# Altium schematic sheet DigitSegment_Schematic.SchDoc
size A
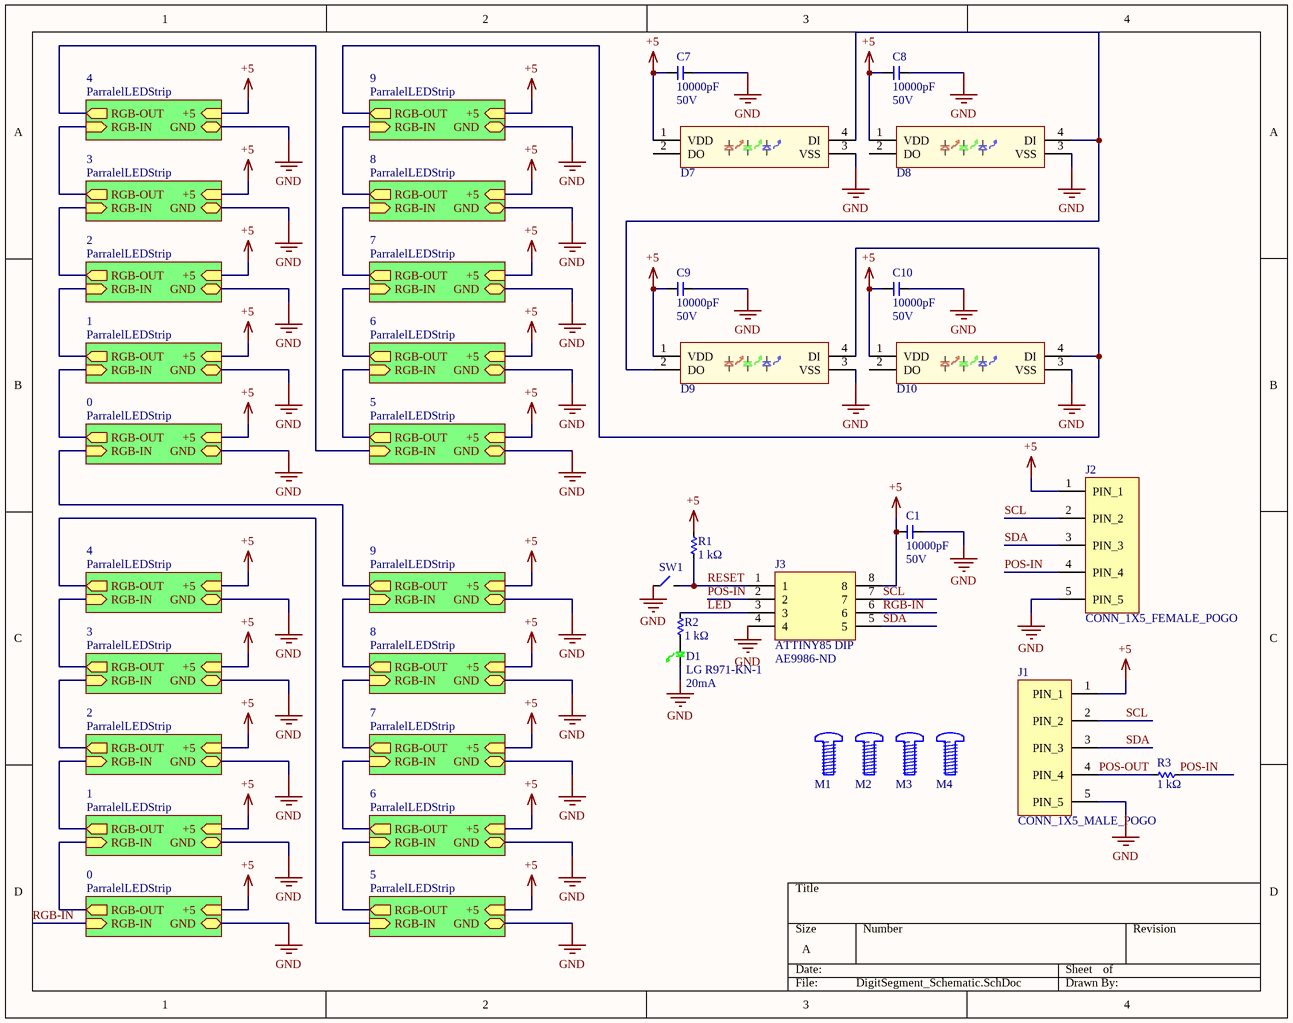
[diagram p0: DigitSegment_Schematic.SchDoc]

## Parts
C1  Capacitance (shorthand): 10000pF  Rated Voltage: 50V  [C0805]  (hidden comment: __template_cap)
C7  Capacitance (shorthand): 10000pF  Rated Voltage: 50V  [C0805]  (hidden comment: __template_cap)
C8  Capacitance (shorthand): 10000pF  Rated Voltage: 50V  [C0805]  (hidden comment: __template_cap)
C9  Capacitance (shorthand): 10000pF  Rated Voltage: 50V  [C0805]  (hidden comment: __template_cap)
C10  Capacitance (shorthand): 10000pF  Rated Voltage: 50V  [C0805]  (hidden comment: __template_cap)
D1  Manufacturer Part Number: LG R971-KN-1  Current - Test: 20mA  [0805_Diode]  (hidden comment: LED_LY971)
D7  LED_WS2812B  [4DFN5X5_WGS2812B]  (value not drawn)
D8  LED_WS2812B  [4DFN5X5_WGS2812B]  (value not drawn)
D9  LED_WS2812B  [4DFN5X5_WGS2812B]  (value not drawn)
D10  LED_WS2812B  [4DFN5X5_WGS2812B]  (value not drawn)
J1  CONN_1X5_MALE_POGO  [CONN_1X5_MALE_POGO]
J2  CONN_1X5_FEMALE_POGO  [CONN_1X5_FEMALE_POGO]
J3  ATTINY85 DIP  Supplier Part Number 1: AE9986-ND  [DIP8]
M1  SCREW_#2-56_5/16  [#2_HOLE]  (value not drawn)
M2  SCREW_#2-56_5/16  [#2_HOLE]  (value not drawn)
M3  SCREW_#2-56_5/16  [#2_HOLE]  (value not drawn)
M4  SCREW_#2-56_5/16  [#2_HOLE]  (value not drawn)
R1  Resistance: 1 kΩ  [R0805]  (hidden comment: __template_resistor)
R2  Resistance: 1 kΩ  [R0805]  (hidden comment: __template_resistor)
R3  Resistance: 1 kΩ  [R0805]  (hidden comment: __template_resistor)
SW1  SWITCH_FSM4JSMATR  [SWITCH_FSM4JSMATR]  (value not drawn)

## Sub-sheets
0 = ParralelLEDStrip: RGB-IN (in), +5 (in), RGB-OUT (out), GND (bidir)
0 = ParralelLEDStrip: RGB-IN (in), +5 (in), RGB-OUT (out), GND (bidir)
1 = ParralelLEDStrip: RGB-IN (in), +5 (in), RGB-OUT (out), GND (bidir)
1 = ParralelLEDStrip: RGB-IN (in), +5 (in), RGB-OUT (out), GND (bidir)
2 = ParralelLEDStrip: RGB-IN (in), +5 (in), RGB-OUT (out), GND (bidir)
2 = ParralelLEDStrip: RGB-IN (in), +5 (in), RGB-OUT (out), GND (bidir)
3 = ParralelLEDStrip: RGB-IN (in), +5 (in), RGB-OUT (out), GND (bidir)
3 = ParralelLEDStrip: RGB-IN (in), +5 (in), RGB-OUT (out), GND (bidir)
4 = ParralelLEDStrip: RGB-IN (in), +5 (in), RGB-OUT (out), GND (bidir)
4 = ParralelLEDStrip: RGB-IN (in), +5 (in), RGB-OUT (out), GND (bidir)
5 = ParralelLEDStrip: RGB-IN (in), +5 (in), RGB-OUT (out), GND (bidir)
5 = ParralelLEDStrip: RGB-IN (in), +5 (in), RGB-OUT (out), GND (bidir)
6 = ParralelLEDStrip: RGB-IN (in), +5 (in), RGB-OUT (out), GND (bidir)
6 = ParralelLEDStrip: RGB-IN (in), +5 (in), RGB-OUT (out), GND (bidir)
7 = ParralelLEDStrip: RGB-IN (in), +5 (in), RGB-OUT (out), GND (bidir)
7 = ParralelLEDStrip: RGB-IN (in), +5 (in), RGB-OUT (out), GND (bidir)
8 = ParralelLEDStrip: RGB-IN (in), +5 (in), RGB-OUT (out), GND (bidir)
8 = ParralelLEDStrip: RGB-IN (in), +5 (in), RGB-OUT (out), GND (bidir)
9 = ParralelLEDStrip: RGB-IN (in), +5 (in), RGB-OUT (out), GND (bidir)
9 = ParralelLEDStrip: RGB-IN (in), +5 (in), RGB-OUT (out), GND (bidir)

## Nets
+5: C1.1 C7.1 C8.1 C9.1 C10.1 D7.1(VDD) D8.1(VDD) D9.1(VDD) D10.1(VDD) J1.1(PIN_1) J2.1(PIN_1) J3.8 R1.2 ; sheet 0/+5, sheet 1/+5, sheet 2/+5, sheet 3/+5, sheet 4/+5, sheet 5/+5, sheet 6/+5, sheet 7/+5, sheet 8/+5, sheet 9/+5, sheet 0/+5, sheet 1/+5, sheet 2/+5, sheet 3/+5, sheet 4/+5, sheet 5/+5, sheet 6/+5, sheet 7/+5, sheet 8/+5, sheet 9/+5
GND: C1.2 C7.2 C8.2 C9.2 C10.2 D1.1 D7.3(VSS) D8.3(VSS) D9.3(VSS) D10.3(VSS) J1.5(PIN_5) J2.5(PIN_5) J3.4 SW1.1 ; sheet 0/GND, sheet 1/GND, sheet 2/GND, sheet 3/GND, sheet 4/GND, sheet 5/GND, sheet 6/GND, sheet 7/GND, sheet 8/GND, sheet 9/GND, sheet 0/GND, sheet 1/GND, sheet 2/GND, sheet 3/GND, sheet 4/GND, sheet 5/GND, sheet 6/GND, sheet 7/GND, sheet 8/GND, sheet 9/GND
LED: J3.3 R2.2
POS-IN: J2.4(PIN_4) J3.2 R3.2
POS-OUT: J1.4(PIN_4) R3.1
RESET: J3.1 R1.1 SW1.2
RGB-IN: J3.6 ; sheet 0/RGB-IN
SCL: J1.2(PIN_2) J2.2(PIN_2) J3.7
SDA: J1.3(PIN_3) J2.3(PIN_3) J3.5
NetD1_2: D1.2 R2.1
NetD7_4: D7.4(DI) D8.4(DI) D9.2(DO)
NetD9_4: D9.4(DI) D10.4(DI) ; sheet 9/RGB-OUT
(unnamed): sheet 0/RGB-IN, sheet 9/RGB-OUT
(unnamed): sheet 0/RGB-OUT, sheet 1/RGB-IN
(unnamed): sheet 1/RGB-OUT, sheet 2/RGB-IN
(unnamed): sheet 2/RGB-OUT, sheet 3/RGB-IN
(unnamed): sheet 3/RGB-OUT, sheet 4/RGB-IN
(unnamed): sheet 4/RGB-OUT, sheet 5/RGB-IN
(unnamed): sheet 5/RGB-OUT, sheet 6/RGB-IN
(unnamed): sheet 6/RGB-OUT, sheet 7/RGB-IN
(unnamed): sheet 7/RGB-OUT, sheet 8/RGB-IN
(unnamed): sheet 8/RGB-OUT, sheet 9/RGB-IN
(unnamed): sheet 0/RGB-OUT, sheet 1/RGB-IN
(unnamed): sheet 1/RGB-OUT, sheet 2/RGB-IN
(unnamed): sheet 2/RGB-OUT, sheet 3/RGB-IN
(unnamed): sheet 3/RGB-OUT, sheet 4/RGB-IN
(unnamed): sheet 4/RGB-OUT, sheet 5/RGB-IN
(unnamed): sheet 5/RGB-OUT, sheet 6/RGB-IN
(unnamed): sheet 6/RGB-OUT, sheet 7/RGB-IN
(unnamed): sheet 7/RGB-OUT, sheet 8/RGB-IN
(unnamed): sheet 8/RGB-OUT, sheet 9/RGB-IN

Not connected (* = marked no-connect by the designer): D7 2(DO); D8 2(DO); D10 2(DO); M1 HOLE(0); M2 HOLE(0); M3 HOLE(0); M4 HOLE(0)

## Library data of the parts
C1 C7-C10 = CAP CER 10000PF 50V X7R 0805: Manufacturer: Murata Electronics North America; Capacitance - pF (Machine readable): 10000; type: capacitor; Dielectric: X7R; Supplier Part Number 1: 490-1664-1-ND
D1 = LED_LY971: LED 0805 GREEN 20MA; Manufacturer: OSRAM Opto Semiconductors Inc; Wavelength - Dominant: 570nm; Wavelength - Peak: 572nm; Millicandela Rating: 26.05mcd; Voltage - Forward (Vf) (Typ): 2.2V; Viewing Angle: 160°; Lens Transparency: Diffused; Lens Color: White; Lens Style/Size: Rectangle with Flat Top, 1.30mm x 1.25mm; Supplier 1: Digi-Key; RoHS: RoHS Compliant; Category: Optoelectronics; Stock 1: 89733; Pricing 1: 1=0.08, 10=0.069, 100=0.0548, 250=0.04796, 500=0.04384 (USD); Packaging: Cut Tape (CT); Color: Green; Package / Case: 0805 (2012 Metric); Supplier Device Package: *; Size / Dimension: 2.00mm L x 1.25mm W; Height (Max): 0.80mm; Mounting Type: Surface Mount; ComponentLink1URL: http://www.osram-os.com/Graphics/XPic9/00078860_0.pdf; ComponentLink1Description: http://www.osram-os.com/Graphics/XPic9/00078860_0.pdf; Supplier Part Number 1: 475-1410-1-ND
D7-D10 = LED_WS2812B: LED RGB WS2812B
J1 = CONN_1X5_MALE_POGO: RIGHT ANGLE .050" GRID SLC
J2 = CONN_1X5_FEMALE_POGO: .050" RA TARGET CONNECTOR
J3 = CONN_DIP_8: CONN IC SOCKET 8POS DIP TIN; Manufacturer: Assmann WSW Components; Manufacturer Part Number: A 08-LC-TT; Number of Positions or Pins (Grid): 8 (2 x 4); Pitch - Mating: 0.100" (2.54mm); Material Flammability Rating: UL94 V-0; Contact Resistance: 30 mOhm; Supplier 1: Digi-Key; RoHS: RoHS Compliant; Category: Connectors, Interconnects; Stock 1: 124929; Pricing 1: 1=0.18, 10=0.173, 25=0.1472, 50=0.1288, 100=0.1196, 250=0.1058, 500=0.1012, 1000=0.0828, 2500=0.0759 (USD); Packaging: Tube; Part Status: Active; Type: DIP, 0.3" (7.62mm) Row Spacing; Contact Finish - Mating: Tin; Contact Finish Thickness - Mating: -; Contact Material - Mating: Phosphor Bronze; Mounting Type: Through Hole; Features: Open Frame; Termination: Solder; Pitch - Post: 0.100" (2.54mm); Contact Finish - Post: Tin; Contact Finish Thickness - Post: -; Contact Material - Post: Phosphor Bronze; Housing Material: Polybutylene Terephthalate (PBT); Operating Temperature: -55°C ~ 85°C; Termination Post Length: 0.124" (3.15mm); ComponentLink1URL: http://www.assmann-wsw.com/fileadmin/datasheets/ASS_0810_CO.pdf; ComponentLink1Description: http://www.assmann-wsw.com/fileadmin/datasheets/ASS_0810_CO.pdf
M1-M4 = SCREW_#2-56_5/16: #2-56 Button Head Screw, 5/16"
R1-R3 = RES SMD 1K OHM 1% 1/8W 0805: Manufacturer Part Number: RC0805FR-071KL; Manufacturer: Yageo; Resistance (Sortable): 1000; Tolerance: ±1%; Power (Watts): 0.125W, 1/8W; Temperature Coefficient: ±100ppm/°C; Supplier 1: Digikey; Datasheets: http://www.yageo.com/documents/recent/PYu-RC_Group_51_RoHS_L_9.pdf; Image: //media.digikey.com/Renders/Yageo%20Renders/0805-(2012-Metric).jpg; Supplier Part Number 1: 311-1.00KCRCT-ND; Operating Temperature: -55°C ~ 155°C
SW1 = SWITCH_FSM4JSMATR: SWITCH TACTILE SPST-NO 0.05A 12V; Manufacturer: TE Connectivity; Switch Function: Off-Mom; Actuator Type: Standard; Actuator Height off PCB, from Pins: 5.00mm; Actuator Orientation: Top Actuated; Outline: 6.00mm x 6.00mm; Illumination: Non-Illuminated; Operating Force: 160gf; Actuator Material: Polyphenylene Sulfide (PPS); Switch Travel: 0.25mm; Mechanical Life: 100,000 Cycles; Contact Rating @ Voltage: 0.05A @ 12VDC; Supplier 1: Digi-Key; Manufacturer Part Number: FSM4JSMATR; RoHS: RoHS Compliant; Category: Switches; Stock 1: 24144; Pricing 1: 1=0.36, 10=0.34, 25=0.2912, 50=0.2474, 100=0.2377, 250=0.21344, 500=0.20374 (USD); Circuit: SPST-NO; Mounting Type: Surface Mount; Termination Style: Gull Wing; Illumination Voltage (Nominal): -; Illumination Type, Color: -; Ingress Protection: -; Features: -; Packaging: Cut Tape (CT); Operating Temperature: -35°C ~ 85°C; ComponentLink1URL: http://www.te.com/commerce/DocumentDelivery/DDEController?Action=srchrtrv&DocNm=2-1437565-7&DocType=Customer+Drawing&DocLang=English; ComponentLink1Description: Datasheet; Supplier Part Number 1: 450-1759-1-ND